# Altium schematic sheet MCU.SchDoc
size A3; SheetNumber: 8; SheetTotal: 9
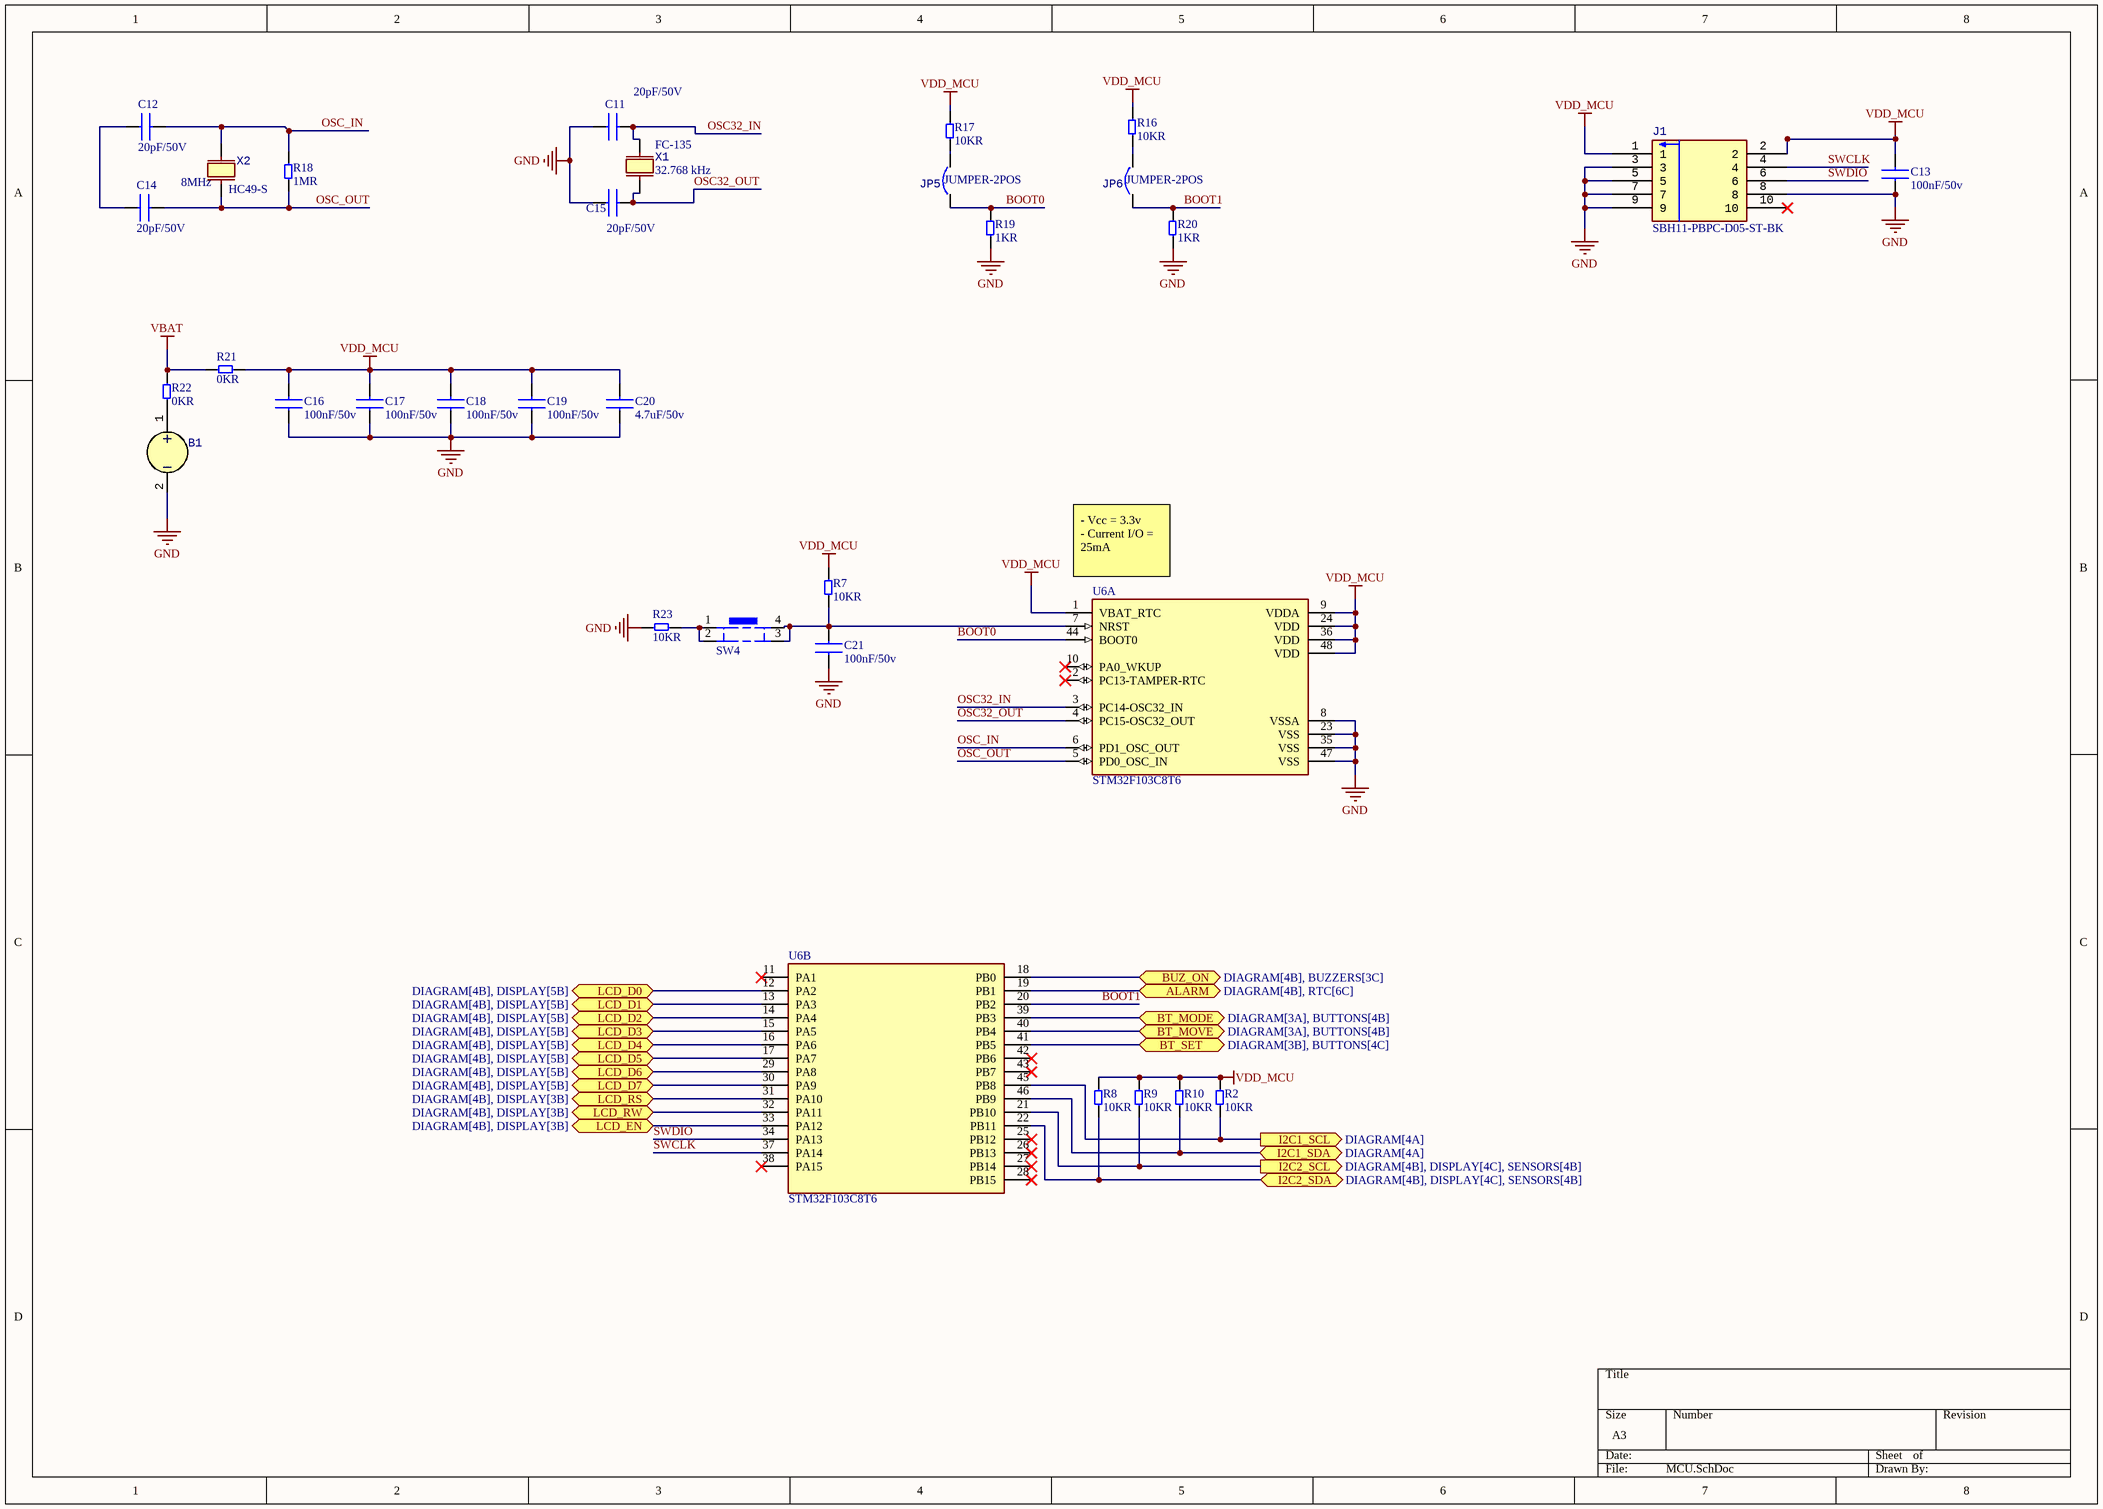
[diagram p0: MCU.SchDoc]

## Parts
B1  0  [BAT-HOLD-2032]  (value not drawn)
C11  20pF/50V  [CAP-CER-0805]
C12  20pF/50V  [CAP-CER-0805]
C13  100nF/50v  [CAP-CER-0805]
C14  20pF/50V  [CAP-CER-0805]
C15  20pF/50V  [CAP-CER-0805]
C16  100nF/50v  [CAP-CER-0805]
C17  100nF/50v  [CAP-CER-0805]
C18  100nF/50v  [CAP-CER-0805]
C19  100nF/50v  [CAP-CER-0805]
C20  4.7uF/50v  [CAP-CER-0805]
C21  100nF/50v  [CAP-CER-0805]
J1  SBH11-PBPC-D05-ST-BK  [IDC-10POS-2.54]
JP5  JUMPER-2POS  [JUMPER-2POS-2.54]
JP6  JUMPER-2POS  [JUMPER-2POS-2.54]
R2  10KR  [RES-SMD-0805]
R7  10KR  [RES-SMD-0805]
R8  10KR  [RES-SMD-0805]
R9  10KR  [RES-SMD-0805]
R10  10KR  [RES-SMD-0805]
R16  10KR  [RES-SMD-0805]
R17  10KR  [RES-SMD-0805]
R18  1MR  [RES-SMD-0805]
R19  1KR  [RES-SMD-0805]
R20  1KR  [RES-SMD-0805]
R21  0KR  [RES-SMD-0805]
R22  0KR  [RES-SMD-0805]
R23  10KR  [RES-SMD-0805]
SW4  0  [Tactice-Switch-TH-12x12-4.5mm]  (value not drawn)
U6  STM32F103C8T6  [QFP50P900X900X160-48N]  (parts A,B of 2)
X1  Mfr# #: FC-135  [XTAL_FC-135_32.7680KA-A0]  (hidden comment: 32.768 kHz)
X2  8MHz  [HC49-S]

## Ports
ALARM (bidir, see DIAGRAM[4B], RTC[6C]), BT_MODE (bidir, see DIAGRAM[3A], BUTTONS[4B]), BT_MOVE (bidir, see DIAGRAM[3A], BUTTONS[4B]), BT_SET (bidir, see DIAGRAM[3B], BUTTONS[4C]), BUZ_ON (bidir, see DIAGRAM[4B], BUZZERS[3C]), I2C1_SCL (out, see DIAGRAM[4A]), I2C1_SDA (bidir, see DIAGRAM[4A]), I2C2_SCL (out, see DIAGRAM[4B], DISPLAY[4C], SENSORS[4B]), I2C2_SDA (bidir, see DIAGRAM[4B], DISPLAY[4C], SENSORS[4B]), LCD_D0 (bidir, see DIAGRAM[4B], DISPLAY[5B]), LCD_D1 (bidir, see DIAGRAM[4B], DISPLAY[5B]), LCD_D2 (bidir, see DIAGRAM[4B], DISPLAY[5B]), LCD_D3 (bidir, see DIAGRAM[4B], DISPLAY[5B]), LCD_D4 (bidir, see DIAGRAM[4B], DISPLAY[5B]), LCD_D5 (bidir, see DIAGRAM[4B], DISPLAY[5B]), LCD_D6 (bidir, see DIAGRAM[4B], DISPLAY[5B]), LCD_D7 (bidir, see DIAGRAM[4B], DISPLAY[5B]), LCD_EN (bidir, see DIAGRAM[4B], DISPLAY[3B]), LCD_RS (bidir, see DIAGRAM[4B], DISPLAY[3B]), LCD_RW (bidir, see DIAGRAM[4B], DISPLAY[3B])

## Nets
GND: B1.2(-) C11.1 C13.1 C15.1 C16.1 C17.1 C18.1 C19.1 C20.1 C21.2 J1.3 J1.5 J1.7 J1.8 J1.9 R19.1 R20.1 R23.1 U6.8(VSSA) U6.23(VSS) U6.35(VSS) U6.47(VSS)
VBAT: R21.1 R22.2
VDD_MCU: C13.2 C16.2 C17.2 C18.2 C19.2 C20.2 J1.1 J1.2 R2.2 R7.2 R8.2 R9.2 R10.2 R16.2 R17.2 R21.2 U6.1(VBAT_RTC) U6.9(VDDA) U6.24(VDD) U6.36(VDD) U6.48(VDD)
ALARM: U6.19(PB1) ; port ALARM
BOOT0: JP5.1 R19.2 U6.44(BOOT0)
BOOT1: JP6.1 R20.2 U6.20(PB2)
BT_MODE: U6.39(PB3) ; port BT_MODE
BT_MOVE: U6.40(PB4) ; port BT_MOVE
BT_SET: U6.41(PB5) ; port BT_SET
BUZ_ON: U6.18(PB0) ; port BUZ_ON
I2C1_SCL: R2.1 U6.45(PB8) ; port I2C1_SCL
I2C1_SDA: R10.1 U6.46(PB9) ; port I2C1_SDA
I2C2_SCL: R9.1 U6.21(PB10) ; port I2C2_SCL
I2C2_SDA: R8.1 U6.22(PB11) ; port I2C2_SDA
LCD_D0: U6.12(PA2) ; port LCD_D0
LCD_D1: U6.13(PA3) ; port LCD_D1
LCD_D2: U6.14(PA4) ; port LCD_D2
LCD_D3: U6.15(PA5) ; port LCD_D3
LCD_D4: U6.16(PA6) ; port LCD_D4
LCD_D5: U6.17(PA7) ; port LCD_D5
LCD_D6: U6.29(PA8) ; port LCD_D6
LCD_D7: U6.30(PA9) ; port LCD_D7
LCD_EN: U6.33(PA12) ; port LCD_EN
LCD_RS: U6.31(PA10) ; port LCD_RS
LCD_RW: U6.32(PA11) ; port LCD_RW
OSC32_IN: C11.2 U6.3(PC14-OSC32_IN) X1.2
OSC32_OUT: C15.2 U6.4(PC15-OSC32_OUT) X1.1
OSC_IN: C12.2 R18.2 U6.6(PD1_OSC_OUT) X2.2
OSC_OUT: C14.2 R18.1 U6.5(PD0_OSC_IN) X2.1
SWCLK: J1.4 U6.37(PA14)
SWDIO: J1.6 U6.34(PA13)
NetB1_1: B1.1(+) R22.1
NetC12_1: C12.1 C14.1
NetC21_1: C21.1 R7.1 SW4.3 SW4.4 U6.7(NRST)
NetJP5_2: JP5.2 R17.1
NetJP6_2: JP6.2 R16.1
NetR23_2: R23.2 SW4.1 SW4.2

Not connected (* = marked no-connect by the designer): J1 10*; U6 2(PC13-TAMPER-RTC)* 10(PA0_WKUP)* 11(PA1)* 25(PB12)* 26(PB13)* 27(PB14)* 28(PB15)* 38(PA15)* 42(PB6)* 43(PB7)*

## Notes on the sheet
- (near U6) - Vcc = 3.3v
  - Current I/O = 25mA

## Library data of the parts
B1 = ID-20: Design Item ID: ID-20
C11 C12 C14 C15 = ID-11: 0805 20pF 50V; Design Item ID: ID-11; Value: 20pF/50V
C13 C16-C19 C21 = ID-14: Tụ Gốm 0805 100nF (0.1uF) 50V; Design Item ID: ID-14; Value: 100nF/50v
C20 = ID-15: Tụ Gốm 0805 4.7uF 50V; Design Item ID: ID-15; Value: 4.7uF/50v
J1 = ID-16: Design Item ID: ID-16; Mfr# #: SBH11-PBPC-D05-ST-BK
JP5 JP6 = ID-7: Design Item ID: ID-7; Mfr# #: JUMPER-2POS
R2 R7-R10 R16 R17 R23 = ID-4: Điện Trở 10 KOhm 0805 1%; Design Item ID: ID-4; Value: 10KR
R18 = ID-12: Điện Trở 1 MOhm 0805 1%; Design Item ID: ID-12; Value: 1MR
R19 R20 = ID-19: Điện Trở 1 KOhm 0805 1%; Design Item ID: ID-19; Value: 1KR
R21 R22 = ID-21: Điện Trở 0 Ohm 0805 1%; Design Item ID: ID-21; Value: 0KR
SW4 = ID-18: Nút Nhấn 6x6mm Cao 6mm 4 Chân Xuyên Lỗ; Design Item ID: ID-18
U6 = STM32F103C8T6: ARM® Cortex®-M3 STM32F1 Microcontroller IC 32-Bit 72MHz 64KB (64K x 8) FLASH 48-LQFP (7x7); MF: STMicroelectronics; SnapEDA_Link: https://www.snapeda.com/parts/STM32F103C8T6/STMicroelectronics/view-part/?ref=snap; Package: LQFP-48 STMicroelectronics; Value: *; MP: STM32F103C8T6; Check_prices: https://www.snapeda.com/parts/STM32F103C8T6/STMicroelectronics/view-part/?ref=eda
X1 = ID-13: Thạch Anh FC-135 32.768KHz 3215; Design Item ID: ID-13; Value: 32.768 kHz
X2 = ID-10: 8 MHz ±30ppm Crystal 18pF 100 Ohms HC-49/US; Design Item ID: ID-10; Mfr# #: HC49-S; Value: 8MHz